# Altium schematic sheet Overview.SchDoc
size A4; Organization: Hochschule Ulm; Address1: Andreas Rehn; Address2: Institut IMM; Address3: Albert-Einstein-Allee 55; Address4: 89081 Ulm; DocumentNumber: 1; SheetNumber: 1; SheetTotal: 3
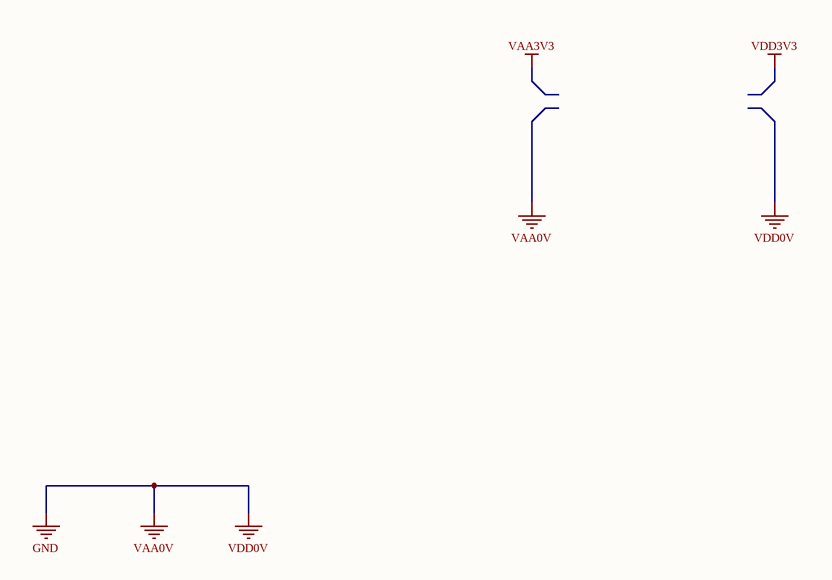
[diagram p0: Overview.SchDoc]

## Notes on the sheet
- Title
- Size:
- Date:
- A4
- Number:
- Time:
- Revision:
- Sheet
- of
- File: